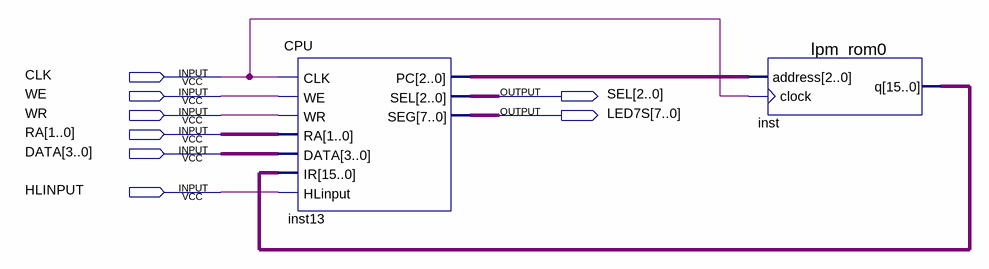
[diagram p0: schematic sheet]
// Quartus schematic TopLevelEntity.bdf as structural Verilog: 2 symbols, 8 pins
module TopLevelEntity (
  input  CLK,
  input  WE,
  input  WR,
  input  [1:0] RA,
  input  [3:0] DATA,
  input  HLINPUT,
  output [2:0] SEL,
  output [7:0] LED7S
);

  wire [2:0] inst13_pc;
  wire [15:0] inst_q;

  CPU inst13 (
    .CLK(CLK), .WE(WE), .WR(WR), .RA(RA), .DATA(DATA), .IR(inst_q), .HLinput(HLINPUT), .PC(inst13_pc),
    .SEL(SEL), .SEG(LED7S));
  lpm_rom0 inst (.address(inst13_pc), .clock(CLK), .q(inst_q));
endmodule
